# EAGLE design PHOTODIODE SENSOR NEW (EAGLE 9.6.2)
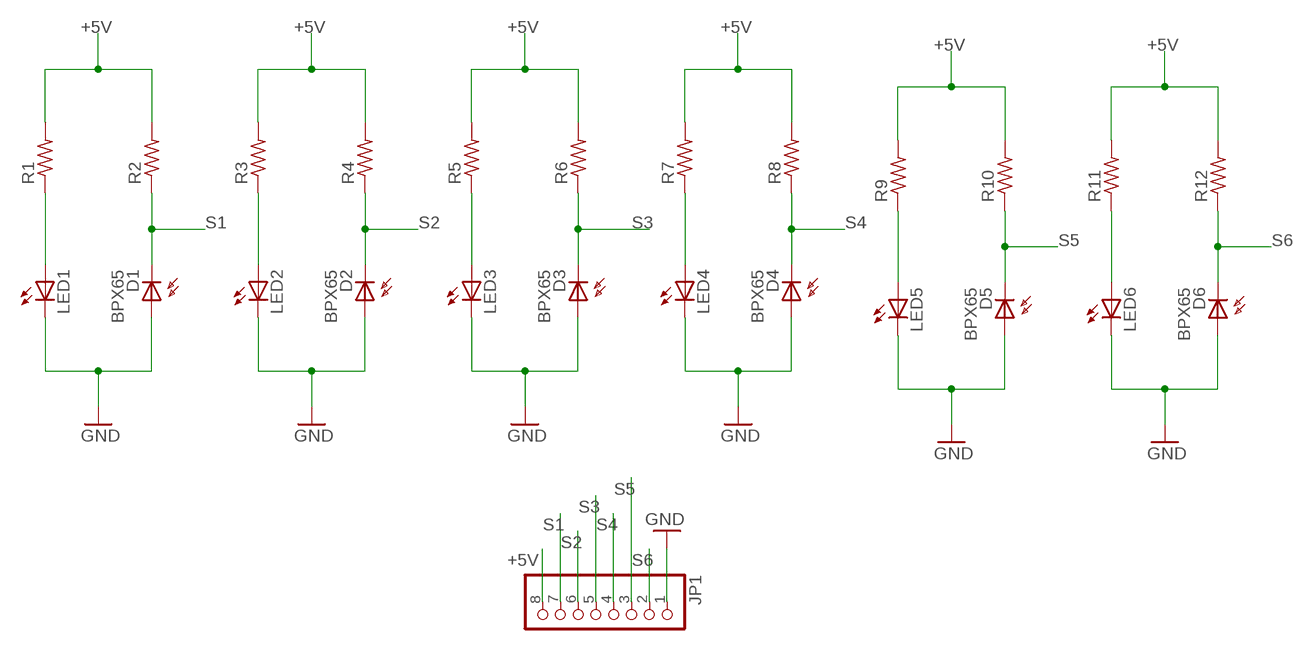
[diagram p0: schematic, sheet 1]

## Parts
D1  BPX65  [BPX65]
D2  BPX65  [BPX65]
D3  BPX65  [BPX65]
D4  BPX65  [BPX65]
D5  BPX65  [BPX65]
D6  BPX65  [BPX65]
JP1  PINHD-1X8  [1X08]
LED1  LED5MM  [LED5MM]
LED2  LED5MM  [LED5MM]
LED3  LED5MM  [LED5MM]
LED4  LED5MM  [LED5MM]
LED5  LED5MM  [LED5MM]
LED6  LED5MM  [LED5MM]
R1  R-US_0204/7  [0204/7]
R2  R-US_0204/7  [0204/7]
R3  R-US_0204/7  [0204/7]
R4  R-US_0204/7  [0204/7]
R5  R-US_0204/7  [0204/7]
R6  R-US_0204/7  [0204/7]
R7  R-US_0204/7  [0204/7]
R8  R-US_0204/7  [0204/7]
R9  R-US_0204/7  [0204/7]
R10  R-US_0204/7  [0204/7]
R11  R-US_0204/7  [0204/7]
R12  R-US_0204/7  [0204/7]

## Nets
+5V: JP1.8 R1.2 R2.2 R3.2 R4.2 R5.2 R6.2 R7.2 R8.2 R9.2 R10.2 R11.2 R12.2
GND: D1.A D2.A D3.A D4.A D5.A D6.A JP1.1 LED1.K(C) LED2.K(C) LED3.K(C) LED4.K(C) LED5.K(C) LED6.K(C)
N$1: LED2.A R3.1
N$2: LED3.A R5.1
N$3: LED1.A R1.1
N$4: LED4.A R7.1
N$5: LED5.A R9.1
N$6: LED6.A R11.1
S1: D1.K(C) JP1.7 R2.1
S2: D2.K(C) JP1.6 R4.1
S3: D3.K(C) JP1.5 R6.1
S4: D4.K(C) JP1.4 R8.1
S5: D5.K(C) JP1.3 R10.1
S6: D6.K(C) JP1.2 R12.1

## Library data of the parts
D1-D6 = opto-trans-siemens:BPX65: PHOTO DIODE; MPN: BPX65.; OC_FARNELL: 327451; OC_NEWARK: 06WX2764
JP1 = pinhead:PINHD-1X8: PIN HEADER
LED1-LED6 = led:LED: LED OSRAM: - CHIPLED LG R971, LG N971, LY N971, LG Q971, LY Q971, LO R971, LY R971 LH N974, LH R974 LS Q976, LO Q976, LY Q976 LO Q996 - Hyper CHIPLED LW Q18S LB Q993, LB Q99A, LB R99A - SideLED LS A670, LO A670, LY A670, LG A670, LP A670 LB A673, LV A673, LT A673, LW A673 LH A674 LY A675 LS A676, LA A676, LO A676, LY A676, LW A676 LS A679, LY A679, LG A679 - Hyper Micro SIDELED® LS Y876, LA Y876, LO Y876, LY Y876 LT Y87S - SmartLED LW L88C, LW L88S LB L89C, LB L89S, LG L890 LS L89K, LO L89K, LY L89K LS L896, LA L896, LO L896, LY L896 - TOPLED LS T670, LO T670, LY T670, LG T670, LP T670 LSG T670, LSP T670, LSY T670, LOP T670, LYG T670 LG T671, LOG T671, LSG T671 LB T673, LV T673, LT T673, LW T673 LH T674 LS T676, LA T676, LO T676, LY T676, LB T676, LH T676, LSB T676, LW T676 LB T67C, LV T67C, LT T67C, LS T67K, LO T67K, LY T67K, LW E67C LS E67B, LA E67B, LO E67B, LY E67B, LB E67C, LV E67C, LT E67C LW T67C LS T679, LY T679, LG T679 LS T770, LO T770, LY T770, LG T770, LP T770 LB T773, LV T773, LT T773, LW T773 LH T774 LS E675, LA E675, LY E675, LS T675 LS T776, LA T776, LO T776, LY T776, LB T776 LHGB T686 LT T68C, LB T68C - Hyper Mini TOPLED® LB M676 - Mini TOPLED Santana® LG M470 LS M47K, LO M47K, LY M47K Source: http://www.osram.convergy.de LUXEON: - LUMILED® LXK2-PW12-R00, LXK2-PW12-S00, LXK2-PW14-U00, LXK2-PW14-V00 LXK2-PM12-R00, LXK2-PM12-S00, LXK2-PM14-U00 LXK2-PE12-Q00, LXK2-PE12-R00, LXK2-PE12-S00, LXK2-PE14-T00, LXK2-PE14-U00 LXK2-PB12-K00, LXK2-PB12-L00, LXK2-PB12-M00, LXK2-PB14-N00, LXK2-PB14-P00, LXK2-PB14-Q00 LXK2-PR12-L00, LXK2-PR12-M00, LXK2-PR14-Q00, LXK2-PR14-R00 LXK2-PD12-Q00, LXK2-PD12-R00, LXK2-PD12-S00 LXK2-PH12-R00, LXK2-PH12-S00 LXK2-PL12-P00, LXK2-PL12-Q00, LXK2-PL12-R00 Source: www.luxeon.com KINGBRIGHT: KA-3528ASYC Source: www.kingbright.com
R1-R12 = rcl:R-US_: RESISTOR, American symbol; SPICEPREFIX: R

## Board
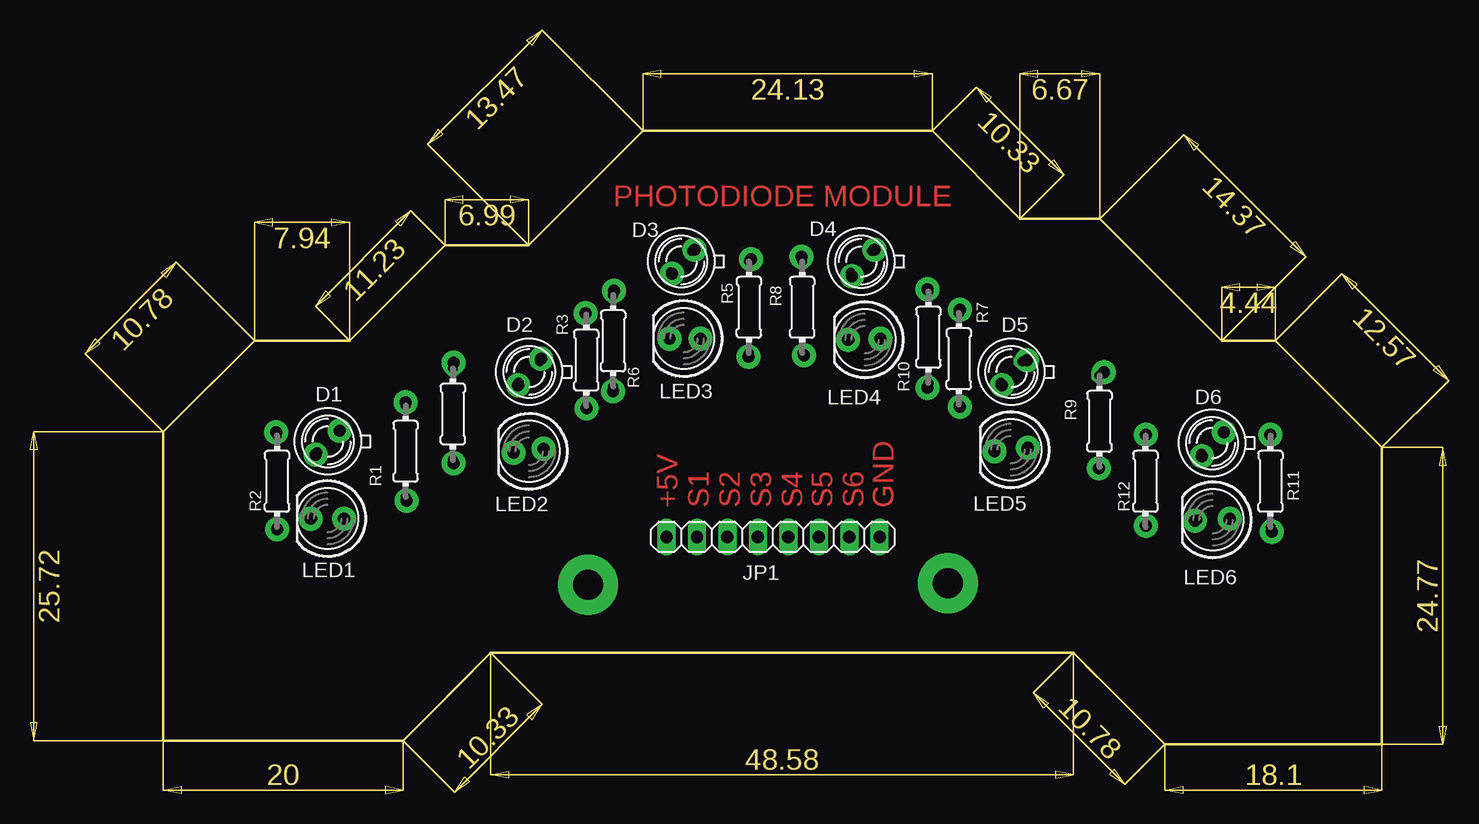
[diagram p1: board, top side]
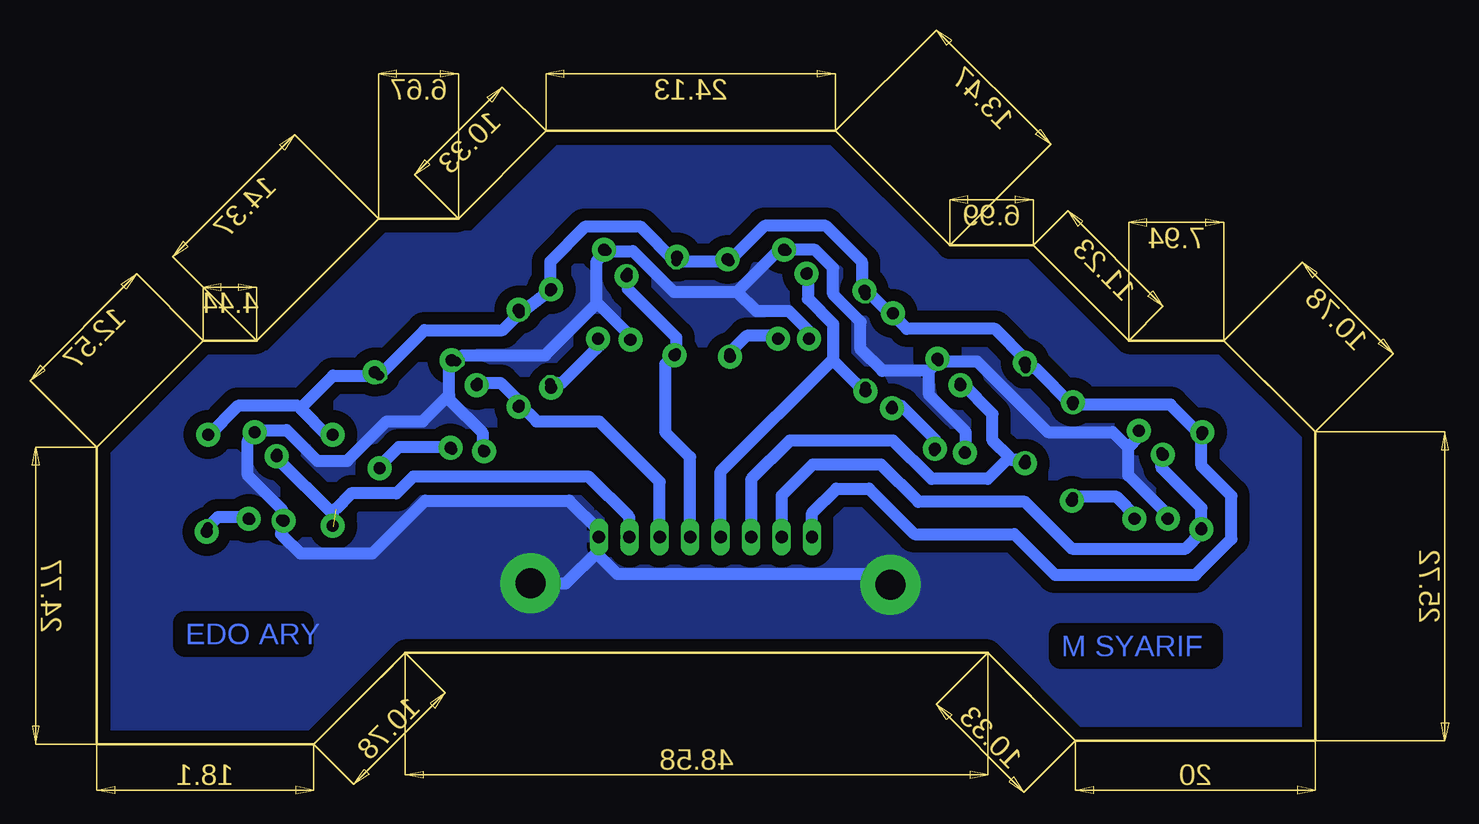
[diagram p2: board, bottom side, seen from below]

Size 101.6 x 51.12 mm. Coordinates in mm from the lower left corner, seen from the top.
Outline: 0,0.32 20,0.32 27.3,7.62 75.88,7.62 83.5,0 101.6,0 101.6,24.77 92.71,33.66 88.27,33.66 78.1,43.82 71.44,43.82 64.13,51.12 40,51.12 30.48,41.59 23.49,41.59 15.56,33.66 7.62,33.66 0,26.04 0,0.32
Copper layers (1*16): Top 0.035mm / dielectric 1.5mm / Bottom 0.035mm
Design rules "default": minimum track width 6mil, minimum drill 0.35mm, track to track 6mil, track to pad 6mil, pad to pad 6mil, via to via 6mil, smd to smd 6mil, copper to edge 40mil, drill to drill 6mil, minimum pad ring 10mil, minimum via ring 8mil, stop-mask expansion 4mil, vias tented up to drill 0mil, thermal gap 10mil

### Footprints (pad centres in the part's own frame; a part is rotated, then mirrored left to right if it is on the bottom)
BPX65 = drill 0.813 octagon: A -0.889,-0.889; K 0.889,0.889
1X08 = drill 1.016 long: 1 -8.89,0; 2 -6.35,0; 3 -3.81,0; 4 -1.27,0; 5 1.27,0; 6 3.81,0; 7 6.35,0; 8 8.89,0
LED5MM = drill 0.813 octagon: A -1.27,0; K 1.27,0
0204/7 = drill 0.813 octagon: 1 -3.81,0; 2 3.81,0

### Placement (x,y rotation side)
D1  13.73,25.23 180 top
D2  30.52,31.03 180 top
D3  43.21,40.23 180 top
D4  58.21,40.22 180 top
D5  70.72,31.02 180 top
D6  87.44,25.1 180 top
JP1  50.85,17.29 180 top
LED1  13.71,18.82 180 top
LED2  30.51,24.42 180 top
LED3  43.41,33.82 180 top
LED4  58.51,33.72 180 top
LED5  70.67,24.55 180 top
LED6  87.51,18.72 180 top
R1  20.22,24.43 90 top
R2  9.5,21.93 90 top
R3  35.28,32.03 90 top
R4  24.16,27.53 90 top
R5  48.84,36.43 90 top
R6  37.52,33.63 90 top
R7  63.8,33.93 90 top
R8  53.28,36.43 90 top
R9  78.06,26.93 90 top
R10  66.34,32.13 90 top
R11  92.32,21.93 90 top
R12  81.9,21.93 90 top

### Tracks (layer width: path | path; a pad name or v marks a point on that pad's centre or on a via)
+5V
  Bottom 1.016: R12.2 82.33,25.74 84.61,28.02 | R11.2 89.84,28.22 84.81,28.22 84.61,28.02 | 84.61,28.02 81.89,30.74 R9.2 74.28,34.52 67.76,34.52 R10.2 66.31,35.91 63.98,37.74 R7.2 63.8,40.23 60.91,43.12 56.21,43.12 53.33,40.24 R8.2 R5.2 48.84,40.29 45.91,43.22 40.81,43.22 37.82,40.23 37.82,37.74 R6.2 37.03,37.44 35.35,35.76 R3.2 34.06,34.62 26.71,34.62 24.16,32.07 R4.2 23.32,31.34 R1.2 20.14,28.32 12.08,28.32 R2.2 9.5,23.21 7.01,20.72 7.01,17.12 10.01,14.12 21.71,14.12 25.11,17.52 33.41,17.52 37.21,21.32 39.93,21.32 41.96,19.29 JP1.8 41.73,17.52
GND  (via drill 2.5 pad 5)
  Bottom 1.016: 15.61,24.73 15.61,22.42 12.32,19.13 12.32,18.94 LED1.K | 15.61,24.73 14.62,25.72 D1.A | 72.21,29.12 72.21,28.72 69.4,25.91 LED5.K | 72.21,29.12 72.21,31.31 D5.A 71.09,32.42 64.21,32.42 59.91,36.72 | 59.91,36.72 59.91,40.3 D4.A 56.9,41.11 53.51,37.72 48.21,37.72 | 59.91,36.72 59.81,36.72 57.24,34.15 LED4.K | 48.21,37.72 44.81,41.12 D3.A 43.99,41.22 41.71,41.22 40.21,39.72 40.21,37.52 37.91,35.22 37.91,32.92 36.11,31.12 32.21,31.12 | 48.21,37.72 46.61,36.12 43.91,36.12 42.1,34.31 42.1,33.86 LED3.K | 32.21,31.12 32.21,29.12 29.14,26.05 29.14,24.52 LED2.K | 32.21,31.12 D2.A 28.21,31.92 22.31,26.02 16.9,26.02 15.61,24.73 | 72.21,29.12 74.41,26.92 77.41,26.92 80.71,23.62 83.21,23.62 85.78,26.19 88.13,26.19 D6.A 89.01,25.31 89.01,22.42 86.1,19.51 86.1,18.86 | 86.1,18.66 86.1,18.86 | 86.14,17.45 84.61,15.92 78.61,15.92 74.21,20.32 62.21,20.32 59.74,17.85 JP1.1 59.74,16.19 62.51,13.42 v65.41,13.42 | 59.81,15.82 58.21,14.22 36.31,14.22 v35.41,13.32 | LED6.K 86.14,18.62 86.14,17.45 | LED6.K 86.1,18.86 | LED6.K 86.24,17.55 86.14,17.45
  pour Bottom (isolate 1.016): 1.21,1.32 1.21,25.32 8.21,32.32 16.21,32.32 24.21,40.32 31.21,40.32 40.41,49.52 63.01,49.52 70.21,42.32 77.21,42.32 87.21,32.32 92.21,32.32 100.21,24.32 100.21,1.32 84.21,1.32 76.81,8.72 26.61,8.72 19.21,1.32
N$1
  Bottom 1.016: R3.1 34.51,28.22 31.68,25.39 31.68,24.52 LED2.A
N$2
  Bottom 1.016: R5.1 47.41,34.05 44.91,34.05 LED3.A
N$3
  Bottom 1.016: R1.1 16.57,20.62 14.88,18.93 14.88,18.92 LED1.A
N$4
  Bottom 1.016: R7.1 62.81,30.12 59.96,32.97 59.78,33.15 | 59.78,33.15 59.64,33.29 59.78,33.43 | LED4.A 59.78,33.15
N$5
  Bottom 1.016: R9.1 76.41,24.77 73.21,24.77 72.16,24.77 | 72.13,24.77 72.16,24.77 | LED5.A 72.16,24.77
N$6
  Bottom 1.016: R11.1 91.51,18.93 88.99,18.93 LED6.A
N$7  (via drill 1 pad 2)
  other vias: 9.51,17.92
N$8  (via drill 1 pad 2)
  other vias: 9.41,26.02
N$9  (via drill 1 pad 2)
  other vias: 12.71,24.12
N$10  (via drill 1 pad 2)
  other vias: 14.71,26.12
N$11  (via drill 1 pad 2)
  other vias: 12.31,18.82
N$12  (via drill 1 pad 2)
  other vias: 15.11,18.82
N$13  (via drill 1 pad 2)
  other vias: 20.21,28.52
N$14  (via drill 1 pad 2)
  other vias: 20.31,20.32
N$15  (via drill 1 pad 2)
  other vias: 24.21,23.42
N$16  (via drill 1 pad 2)
  other vias: 24.21,31.82
N$17  (via drill 1 pad 2)
  other vias: 31.51,32.12
N$18  (via drill 1 pad 2)
  other vias: 29.61,29.92
N$19  (via drill 1 pad 2)
  other vias: 29.21,24.32
N$20  (via drill 1 pad 2)
  other vias: 31.71,24.62
N$21  (via drill 1 pad 2)
  other vias: 35.31,28.02
N$22  (via drill 1 pad 2)
  other vias: 35.21,35.92
N$23  (via drill 1 pad 2)
  other vias: 37.51,29.42
N$24  (via drill 1 pad 2)
  other vias: 37.61,37.82
N$25  (via drill 1 pad 2)
  other vias: 42.21,33.82
N$26  (via drill 1 pad 2)
  other vias: 44.81,33.82
N$27  (via drill 1 pad 2)
  other vias: 42.41,39.22
N$28  (via drill 1 pad 2)
  other vias: 44.31,41.22
N$29  (via drill 1 pad 2)
  other vias: 49.01,40.42
N$30  (via drill 1 pad 2)
  other vias: 53.21,40.62
N$31  (via drill 1 pad 2)
  other vias: 48.81,32.32
N$32  (via drill 1 pad 2)
  other vias: 53.41,32.42
N$33  (via drill 1 pad 2)
  other vias: 57.11,33.72
N$34  (via drill 1 pad 2)
  other vias: 57.41,39.02
N$35  (via drill 1 pad 2)
  other vias: 59.81,33.82
N$36  (via drill 1 pad 2)
  other vias: 63.71,37.92
N$37  (via drill 1 pad 2)
  other vias: 66.41,36.22
N$38  (via drill 1 pad 2)
  other vias: 63.71,29.72
N$39  (via drill 1 pad 2)
  other vias: 66.41,28.12
N$40  (via drill 1 pad 2)
  other vias: 69.91,29.92
N$41  (via drill 1 pad 2)
  other vias: 72.01,32.02
N$42  (via drill 1 pad 2)
  other vias: 78.41,31.02
N$43  (via drill 1 pad 2)
  other vias: 69.31,24.42
N$44  (via drill 1 pad 2)
  other vias: 72.11,24.72
N$45  (via drill 1 pad 2)
  other vias: 78.01,23.02
N$46  (via drill 1 pad 2)
  other vias: 81.91,25.82
N$47  (via drill 1 pad 2)
  other vias: 81.91,18.22
N$48  (via drill 1 pad 2)
  other vias: 86.01,18.62
N$49  (via drill 1 pad 2)
  other vias: 88.91,18.82
N$50  (via drill 1 pad 2)
  other vias: 92.41,17.72
N$51  (via drill 1 pad 2)
  other vias: 92.31,25.82
N$52  (via drill 1 pad 2)
  other vias: 59.31,41.22
N$53  (via drill 1 pad 2)
  other vias: 86.61,24.02
N$54  (via drill 1 pad 2)
  other vias: 88.41,26.02
S1
  Bottom 1.016: D1.K 12.84,23.05 9.5,19.71 R2.1 9.5,17.63 10.81,16.32 20.31,16.32 24.21,20.22 33.11,20.22 36.21,23.32 41.91,23.32 44.5,20.73 JP1.7
S2
  Bottom 1.016: R4.1 25.31,23.72 25.51,23.92 | 25.51,23.92 26.91,25.32 26.91,27.52 29.53,30.14 D2.K | 25.51,23.92 27.31,22.12 32.01,22.12 35.21,25.32 43.81,25.32 47.04,22.09 JP1.6
S3
  Bottom 1.016: JP1.5 49.58,22.75 40.22,32.11 | D3.K 42.32,37.13 40.22,35.03 40.22,32.11 | 40.22,32.11 40.22,32.01 37.82,29.61 37.82,29.82 R6.1
S4
  Bottom 1.016: D4.K 57.32,37.93 53.28,33.89 R8.1 54.21,31.69 54.21,26.02 52.12,23.93 JP1.4
S5
  Bottom 1.016: D5.K 67.93,30.13 66.34,28.54 R10.1 64.94,26.92 59.71,26.92 54.66,21.87 JP1.3
S6  (1 unrouted)
  Bottom 1.016: R12.1 81.9,19.21 86.55,23.86 D6.K | JP1.2 57.2,18.91 60.61,22.32 75.21,22.32 76.61,20.92 80.39,20.92 81.7,19.61

### Text on the board
Top: PHOTODIODE MODULE | +5V | S1 | S2 | S3 | S4 | S5 | S6 | GND
Bottom: EDO ARY | M SYARIF